# Altium schematic sheet PlausabilityTrigger.SchDoc
size A
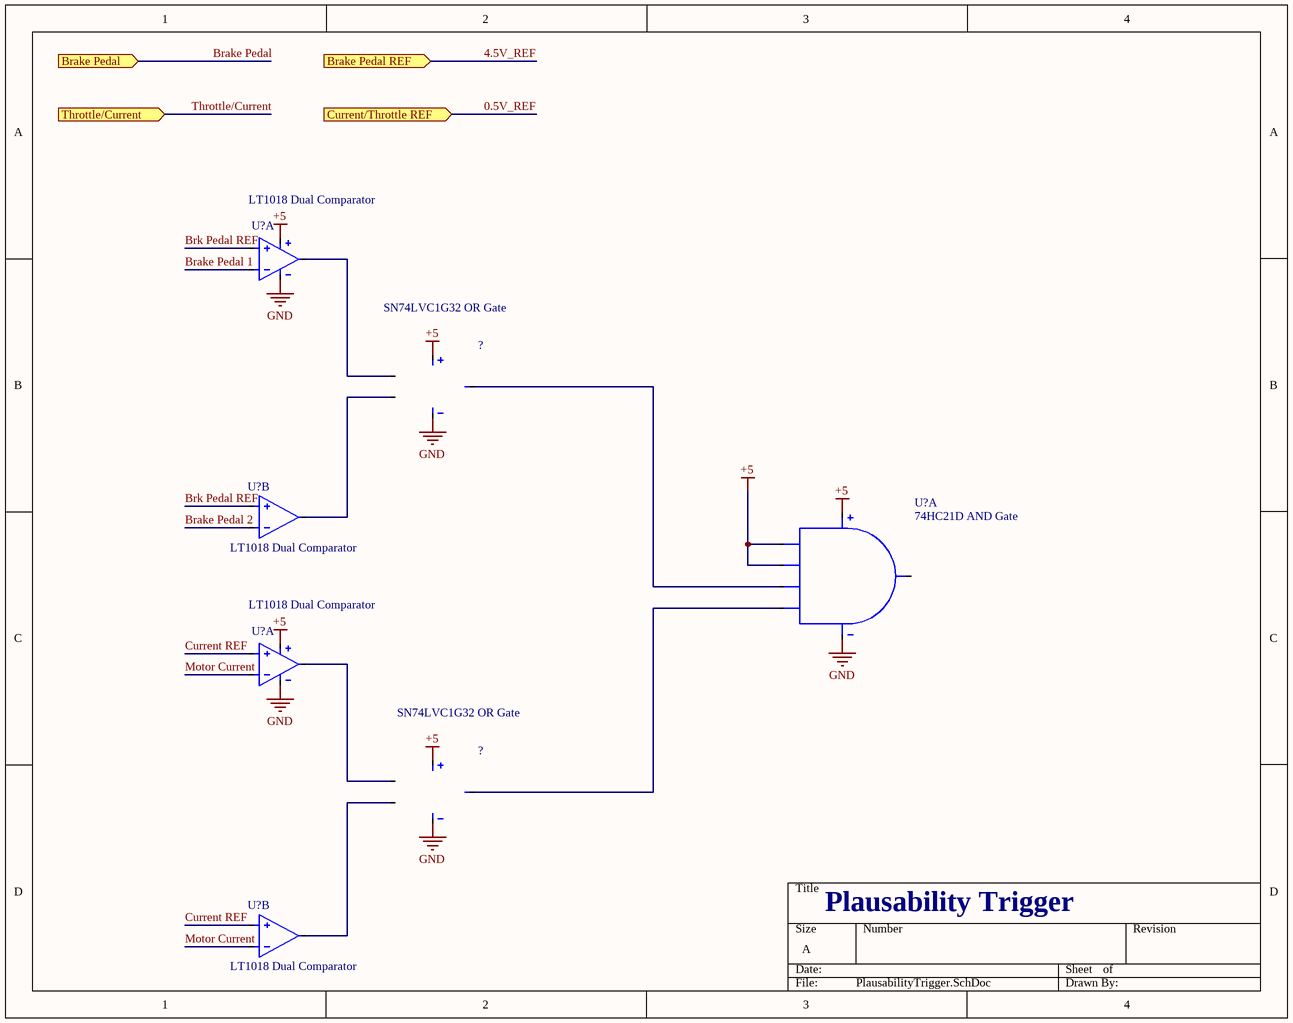
[diagram p0: PlausabilityTrigger.SchDoc]

## Parts
(Parts that share a designator on the sheet are numbered #1, #2 ... from top to bottom, then left to right.)
?#1  SN74LVC1G32 OR Gate  [SOT23-5]
?#2  SN74LVC1G32 OR Gate  [SOT23-5]
U?#1  LT1018 Dual Comparator  [SOIC-8]  (part A of 2)
U?#2  LT1018 Dual Comparator  [SOIC-8]  (part B of 2)
U?#3  74HC21D AND Gate  [SOT108-1]  (part A of 2)
U?#4  LT1018 Dual Comparator  [SOIC-8]  (part A of 2)
U?#5  LT1018 Dual Comparator  [SOIC-8]  (part B of 2)

## Ports
Brake Pedal (in), Brake Pedal REF (in), Current/Throttle REF (in), Throttle/Current (in)

## Nets
+5: ?#1.5(Vcc) ?#2.5(Vcc) U?#1.6(V+) U?#3.1(1A) U?#3.2(1B) U?#3.14(Vcc) U?#4.6(V+)
GND: ?#1.3(GND) ?#2.3(GND) U?#1.2(V-) U?#3.7(GND) U?#4.2(V-)
0.5V_REF: port Current/Throttle REF
4.5V_REF: port Brake Pedal REF
Brake Pedal: port Brake Pedal
Brake Pedal 1: U?#1.8(-IN_A)
Brake Pedal 2: U?#2.4(-IN_B)
Brk Pedal REF: U?#1.1(+IN_A) U?#2.3(+IN_B)
Current REF: U?#4.1(+IN_A) U?#5.3(+IN_B)
Motor Current: U?#4.8(-IN_A) U?#5.4(-IN_B)
Throttle/Current: port Throttle/Current
Net?#1_1: ?#1.1(A) U?#1.7(OUT_A)
Net?#1_2: ?#1.2(B) U?#2.5(OUT_B)
Net?#1_4: ?#1.4(B) U?#3.4(1C)
Net?#2_1: ?#2.1(A) U?#4.7(OUT_A)
Net?#2_2: ?#2.2(B) U?#5.5(OUT_B)
Net?#2_4: ?#2.4(B) U?#3.5(1D)

Not connected (* = marked no-connect by the designer): U?#3 6(1Y)

## Notes on the sheet
- Plausability Trigger

## Library data of the parts
?#1 ?#2 = 14: Manufacturer_id: 1; idIC_Misc: 14; Drawer_id: 1; Name: SN74LVC1G32 OR GATE
U?#1 U?#2 U?#4 U?#5 = 7: Manufacturer_id: 1; MfrPartNo: LT1018CS8#PBF; idIC_Misc: 7; Drawer_id: 1; Name: LT1018 Dual Comparator; Link: https://www.digikey.com/product-detail/en/linear-technology-analog-devices/LT1018CS8-PBF/LT1018CS8-PBF-ND/894434
U?#3 = 15: Manufacturer_id: 1; idIC_Misc: 15; Name: 74HC21D_AND_Gate; Drawer_id: 1